# Altium schematic sheet 5-PWR_ADC.SCHDOC
size A4
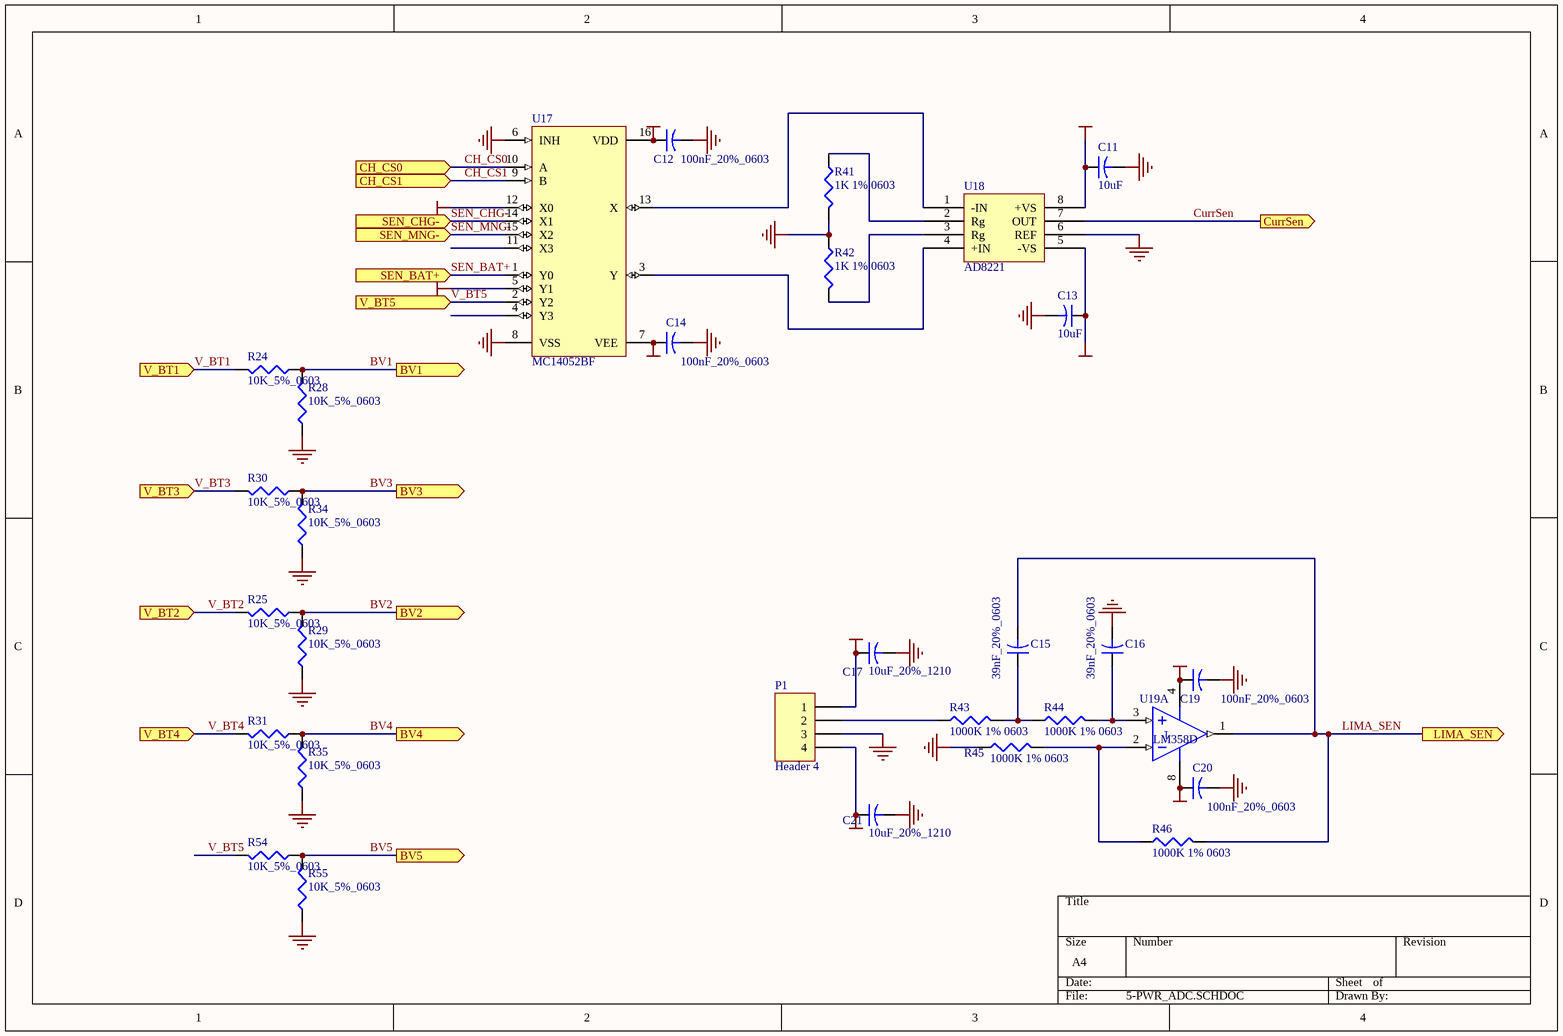
[diagram p0: 5-PWR_ADC.SCHDOC]

## Parts
C11  value 10uF  [C1608-0603]  (hidden comment: Cap2)
C12  100nF_20%_0603  [C1608-0603]
C13  value 10uF  [C1608-0603]  (hidden comment: Cap2)
C14  100nF_20%_0603  [C1608-0603]
C15  39nF_20%_0603  [C1608-0603]
C16  39nF_20%_0603  [C1608-0603]
C17  10uF_20%_1210  [CC3216-1206]
C19  100nF_20%_0603  [C1608-0603]
C20  100nF_20%_0603  [C1608-0603]
C21  10uF_20%_1210  [CC3216-1206]
P1  Header 4  [XH-04H]
R24  10K_5%_0603  [C1608-0603]
R25  10K_5%_0603  [C1608-0603]
R28  10K_5%_0603  [C1608-0603]
R29  10K_5%_0603  [C1608-0603]
R30  10K_5%_0603  [C1608-0603]
R31  10K_5%_0603  [C1608-0603]
R34  10K_5%_0603  [C1608-0603]
R35  10K_5%_0603  [C1608-0603]
R41  value 1K 1% 0603  [C1608-0603]  (hidden comment: 1K_5%_0603)
R42  value 1K 1% 0603  [C1608-0603]  (hidden comment: 1K_5%_0603)
R43  value 1000K 1% 0603  [C1608-0603]  (hidden comment: 1K_5%_0603)
R44  value 1000K 1% 0603  [C1608-0603]  (hidden comment: 1K_5%_0603)
R45  value 1000K 1% 0603  [C1608-0603]  (hidden comment: 1K_5%_0603)
R46  value 1000K 1% 0603  [C1608-0603]  (hidden comment: 1K_5%_0603)
R54  10K_5%_0603  [C1608-0603]
R55  10K_5%_0603  [C1608-0603]
U17  MC14052BF  [966-01]
U18  AD8221  [MSOP8]
U19  LM358D  [751-02]  (part A of 2)

## Ports
BV1 (out), BV2 (out), BV3 (out), BV4 (out), BV5 (out), CH_CS0 (in), CH_CS1 (in), CurrSen (out), LIMA_SEN (out), SEN_BAT+ (in), SEN_CHG- (in), SEN_MNG- (in), V_BT1 (in), V_BT2 (in), V_BT3 (in), V_BT4 (in), V_BT5 (in)

## Nets
GND: C11.2 C12.2 C13.2 C14.2 C16.2 C17.2 C19.2 C20.2 C21.2 P1.3 R28.1 R29.1 R34.1 R35.1 R41.2 R42.1 R45.1 R55.1 U17.6(INH) U17.8(VSS) U18.6(REF)
VCC_5V: C11.1 C12.1 C17.1 C20.1 P1.1 U17.16(VDD) U18.8(+VS) U19.8(V+)
VCC_-5V: C13.1 C14.1 C19.1 C21.1 P1.4 U17.7(VEE) U18.5(-VS) U19.4(V-)
VCC_BAT: U17.12(X0)
VCC_CHARGE: U17.5(Y1)
BV1: R24.1 R28.2 ; port BV1
BV2: R25.1 R29.2 ; port BV2
BV3: R30.1 R34.2 ; port BV3
BV4: R31.1 R35.2 ; port BV4
BV5: R54.1 R55.2 ; port BV5
CH_CS0: U17.10(A) ; port CH_CS0
CH_CS1: U17.9(B) ; port CH_CS1
CurrSen: U18.7(OUT) ; port CurrSen
LIMA_SEN: C15.2 R46.2 U19.1(OUT) ; port LIMA_SEN
SEN_BAT+: U17.1(Y0) ; port SEN_BAT+
SEN_CHG-: U17.14(X1) ; port SEN_CHG-
SEN_MNG-: U17.15(X2) ; port SEN_MNG-
V_BT1: R24.2 ; port V_BT1
V_BT2: R25.2 ; port V_BT2
V_BT3: R30.2 ; port V_BT3
V_BT4: R31.2 ; port V_BT4
V_BT5: R54.2 U17.2(Y2) ; port V_BT5
NetC15_1: C15.1 R43.2 R44.1
NetC16_1: C16.1 R44.2 U19.3(IN+)
NetP1_2: P1.2 R43.1
NetR41_1: R41.1 U18.2(Rg)
NetR42_2: R42.2 U18.3(Rg)
NetR45_2: R45.2 R46.1 U19.2(IN-)
NetU17_3: U17.3(Y) U18.4(+IN)
NetU17_13: U17.13(X) U18.1(-IN)

Not connected (* = marked no-connect by the designer): U17 4(Y3) 11(X3)

## Library data of the parts
C11 C13 = Cap2: Capacitor; Published: 23-Sep-2002; Publisher: Altium Limited
C12 C14-C17 C19-C21 = Cap2: Capacitor; Value: 0.1uF 20% 0603; Published: 23-Sep-2002; Publisher: Altium Limited
P1 = Header 4: Header, 4-Pin; LatestRevisionDate: 17-Jul-2002; LatestRevisionNote: Re-released for DXP Platform.; Publisher: Altium Limited
R24 R25 R28-R31 R34 R35 R54 R55 = Res3: Resistor; Value: 150R %5 0603; Published: 8-Jun-2000; Revision: July-2002: Re-released for DXP Platform.; Publisher: Altium Limited
R41-R46 = Res3: Resistor; Published: 8-Jun-2000; Revision: July-2002: Re-released for DXP Platform.; Publisher: Altium Limited
U17 = MC14052BF: Dual 4-Channel Analog Multiplexer/Demultiplexer; Published: 17-Jul-2002; DatasheetDocument: Mar-2000; PackageDocument: Mar-2000; PackageReference: 966-01; Publisher: Altium Limited
U19 = LM358D: Dual Low-Power Operational Amplifier; Published: 17-Jul-2002; DatasheetDocument: 1988; PackageReference: 751-02; Publisher: Altium Limited; Code_JEDEC: MS-012-AA; Code_IPC: SO8